# Altium schematic sheet 07-KSZ9031_1G_BASET_XCVR.SchDoc
size C; SheetNumber: 7; SheetTotal: 13
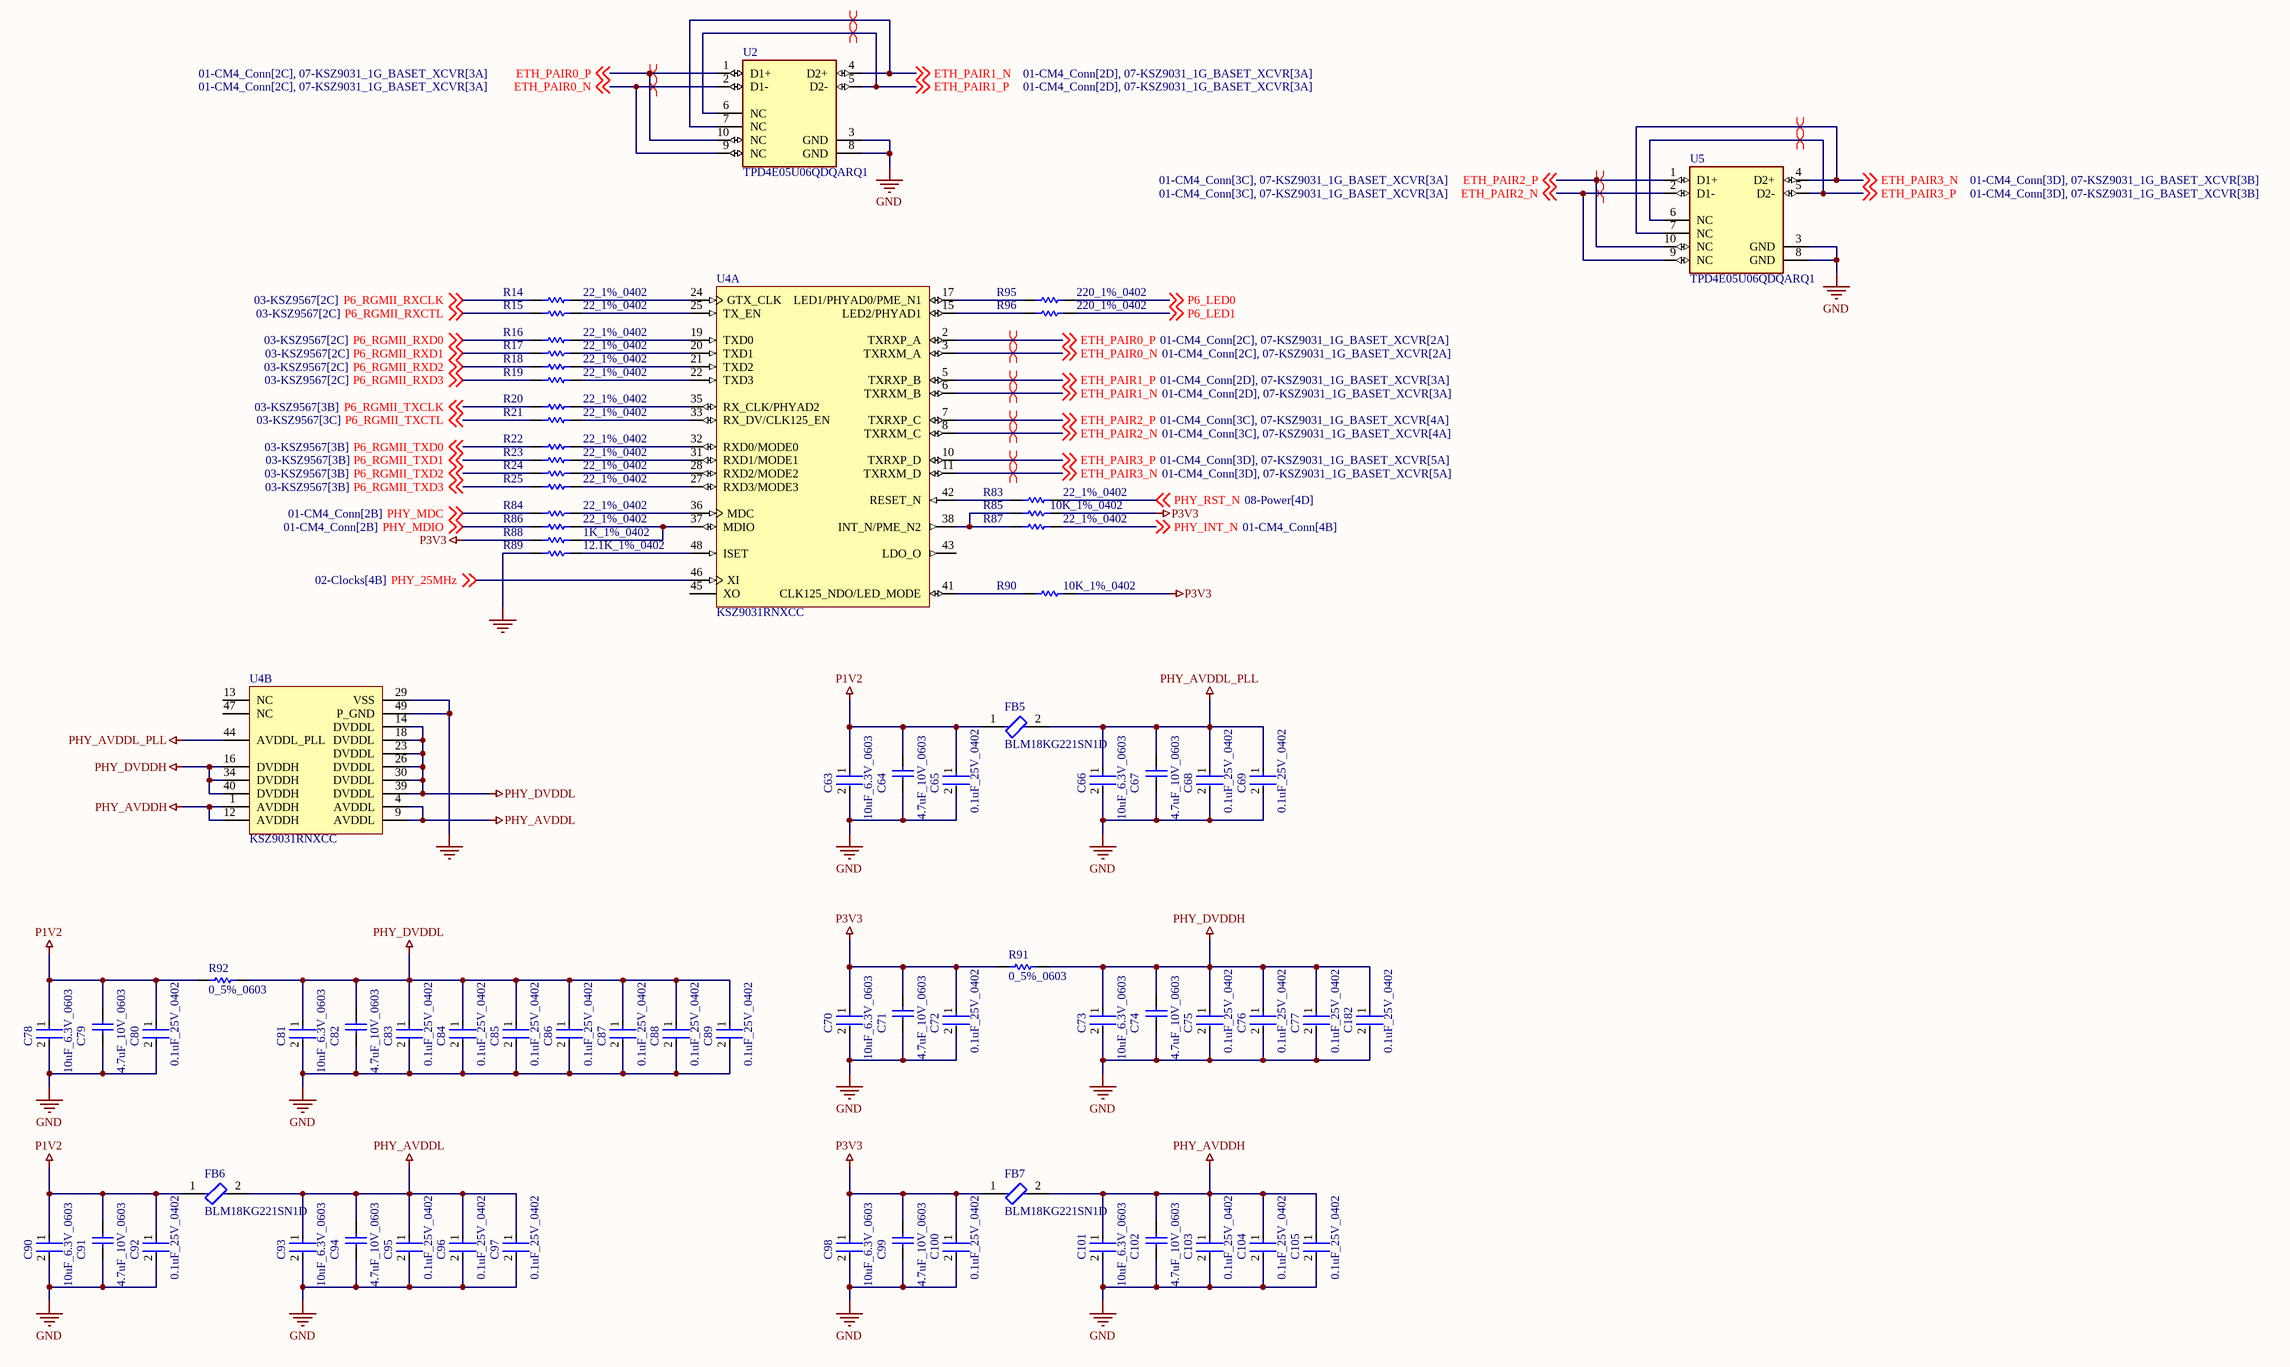
[diagram p0: 07-KSZ9031_1G_BASET_XCVR.SchDoc]

## Parts
C63  10uF_6.3V_0603  [FP-C0603C106M9PACTU-MFG]
C64  4.7uF_10V_0603  [CAPC1608X87X35NL15T15]
C65  0.1uF_25V_0402  [FP-0402-L_1_0_1-W_0_5_0_1-IPC_C]
C66  10uF_6.3V_0603  [FP-C0603C106M9PACTU-MFG]
C67  4.7uF_10V_0603  [CAPC1608X87X35NL15T15]
C68  0.1uF_25V_0402  [FP-0402-L_1_0_1-W_0_5_0_1-IPC_C]
C69  0.1uF_25V_0402  [FP-0402-L_1_0_1-W_0_5_0_1-IPC_C]
C70  10uF_6.3V_0603  [FP-C0603C106M9PACTU-MFG]
C71  4.7uF_10V_0603  [CAPC1608X87X35NL15T15]
C72  0.1uF_25V_0402  [FP-0402-L_1_0_1-W_0_5_0_1-IPC_C]
C73  10uF_6.3V_0603  [FP-C0603C106M9PACTU-MFG]
C74  4.7uF_10V_0603  [CAPC1608X87X35NL15T15]
C75  0.1uF_25V_0402  [FP-0402-L_1_0_1-W_0_5_0_1-IPC_C]
C76  0.1uF_25V_0402  [FP-0402-L_1_0_1-W_0_5_0_1-IPC_C]
C77  0.1uF_25V_0402  [FP-0402-L_1_0_1-W_0_5_0_1-IPC_C]
C78  10uF_6.3V_0603  [FP-C0603C106M9PACTU-MFG]
C79  4.7uF_10V_0603  [CAPC1608X87X35NL15T15]
C80  0.1uF_25V_0402  [FP-0402-L_1_0_1-W_0_5_0_1-IPC_C]
C81  10uF_6.3V_0603  [FP-C0603C106M9PACTU-MFG]
C82  4.7uF_10V_0603  [CAPC1608X87X35NL15T15]
C83  0.1uF_25V_0402  [FP-0402-L_1_0_1-W_0_5_0_1-IPC_C]
C84  0.1uF_25V_0402  [FP-0402-L_1_0_1-W_0_5_0_1-IPC_C]
C85  0.1uF_25V_0402  [FP-0402-L_1_0_1-W_0_5_0_1-IPC_C]
C86  0.1uF_25V_0402  [FP-0402-L_1_0_1-W_0_5_0_1-IPC_C]
C87  0.1uF_25V_0402  [FP-0402-L_1_0_1-W_0_5_0_1-IPC_C]
C88  0.1uF_25V_0402  [FP-0402-L_1_0_1-W_0_5_0_1-IPC_C]
C89  0.1uF_25V_0402  [FP-0402-L_1_0_1-W_0_5_0_1-IPC_C]
C90  10uF_6.3V_0603  [FP-C0603C106M9PACTU-MFG]
C91  4.7uF_10V_0603  [CAPC1608X87X35NL15T15]
C92  0.1uF_25V_0402  [FP-0402-L_1_0_1-W_0_5_0_1-IPC_C]
C93  10uF_6.3V_0603  [FP-C0603C106M9PACTU-MFG]
C94  4.7uF_10V_0603  [CAPC1608X87X35NL15T15]
C95  0.1uF_25V_0402  [FP-0402-L_1_0_1-W_0_5_0_1-IPC_C]
C96  0.1uF_25V_0402  [FP-0402-L_1_0_1-W_0_5_0_1-IPC_C]
C97  0.1uF_25V_0402  [FP-0402-L_1_0_1-W_0_5_0_1-IPC_C]
C98  10uF_6.3V_0603  [FP-C0603C106M9PACTU-MFG]
C99  4.7uF_10V_0603  [CAPC1608X87X35NL15T15]
C100  0.1uF_25V_0402  [FP-0402-L_1_0_1-W_0_5_0_1-IPC_C]
C101  10uF_6.3V_0603  [FP-C0603C106M9PACTU-MFG]
C102  4.7uF_10V_0603  [CAPC1608X87X35NL15T15]
C103  0.1uF_25V_0402  [FP-0402-L_1_0_1-W_0_5_0_1-IPC_C]
C104  0.1uF_25V_0402  [FP-0402-L_1_0_1-W_0_5_0_1-IPC_C]
C105  0.1uF_25V_0402  [FP-0402-L_1_0_1-W_0_5_0_1-IPC_C]
C182  0.1uF_25V_0402  [FP-0402-L_1_0_1-W_0_5_0_1-IPC_C]
FB5  BLM18KG221SN1D  [FP-BLM18-0_15-t0_8-IPC_B]
FB6  BLM18KG221SN1D  [FP-BLM18-0_15-t0_8-IPC_B]
FB7  BLM18KG221SN1D  [FP-BLM18-0_15-t0_8-IPC_B]
R14  22_1%_0402  [RESC1005X40X25ML05T10]
R15  22_1%_0402  [RESC1005X40X25ML05T10]
R16  22_1%_0402  [RESC1005X40X25ML05T10]
R17  22_1%_0402  [RESC1005X40X25ML05T10]
R18  22_1%_0402  [RESC1005X40X25ML05T10]
R19  22_1%_0402  [RESC1005X40X25ML05T10]
R20  22_1%_0402  [RESC1005X40X25ML05T10]
R21  22_1%_0402  [RESC1005X40X25ML05T10]
R22  22_1%_0402  [RESC1005X40X25ML05T10]
R23  22_1%_0402  [RESC1005X40X25ML05T10]
R24  22_1%_0402  [RESC1005X40X25ML05T10]
R25  22_1%_0402  [RESC1005X40X25ML05T10]
R83  22_1%_0402  [RESC1005X40X25ML05T10]
R84  22_1%_0402  [RESC1005X40X25ML05T10]
R85  10K_1%_0402  [RESC1005X40X25NL10T10]
R86  22_1%_0402  [RESC1005X40X25ML05T10]
R87  22_1%_0402  [RESC1005X40X25ML05T10]
R88  1K_1%_0402  [RESC1005X40X25ML05T10]
R89  12.1K_1%_0402  [RESC1005X40X25NL10T10]
R90  10K_1%_0402  [RESC1005X40X25NL10T10]
R91  0_5%_0603  [RESC1608X55X25ML10T15]
R92  0_5%_0603  [RESC1608X55X25ML10T15]
R95  220_1%_0402  [RESC1005X40X25NL05T10]
R96  220_1%_0402  [RESC1005X40X25NL05T10]
U2  TPD4E05U06QDQARQ1  [FP-DQA0010A-MFG]
U4  KSZ9031RNXCC  [MICL-QFN-48_V]  (parts A,B of 2)
U5  TPD4E05U06QDQARQ1  [FP-DQA0010A-MFG]

## Nets
GND: C63.2 C64.1 C65.2 C66.2 C67.1 C68.2 C69.2 C70.2 C71.1 C72.2 C73.2 C74.1 C75.2 C76.2 C77.2 C78.2 C79.1 C80.2 C81.2 C82.1 C83.2 C84.2 C85.2 C86.2 C87.2 C88.2 C89.2 C90.2 C91.1 C92.2 C93.2 C94.1 C95.2 C96.2 C97.2 C98.2 C99.1 C100.2 C101.2 C102.1 C103.2 C104.2 C105.2 C182.2 R89.1 U2.3(GND) U2.8(GND) U4.29(VSS) U4.49(P_GND) U5.3(GND) U5.8(GND)
P1V2: C63.1 C64.2 C65.1 C78.1 C79.2 C80.1 C90.1 C91.2 C92.1 FB5.1 FB6.1 R92.1
P3V3: C70.1 C71.2 C72.1 C98.1 C99.2 C100.1 FB7.1 R85.2 R88.1 R90.2 R91.1
PHY_AVDDH: C101.1 C102.2 C103.1 C104.1 C105.1 FB7.2 U4.1(AVDDH) U4.12(AVDDH)
PHY_AVDDL: C93.1 C94.2 C95.1 C96.1 C97.1 FB6.2 U4.4(AVDDL) U4.9(AVDDL)
PHY_AVDDL_PLL: C66.1 C67.2 C68.1 C69.1 FB5.2 U4.44(AVDDL_PLL)
PHY_DVDDH: C73.1 C74.2 C75.1 C76.1 C77.1 C182.1 R91.2 U4.16(DVDDH) U4.34(DVDDH) U4.40(DVDDH)
PHY_DVDDL: C81.1 C82.2 C83.1 C84.1 C85.1 C86.1 C87.1 C88.1 C89.1 R92.2 U4.14(DVDDL) U4.18(DVDDL) U4.23(DVDDL) U4.26(DVDDL) U4.30(DVDDL) U4.39(DVDDL)
ETH_PAIR0_N: U2.2(D1-) U2.9(NC) U4.3(TXRXM_A) ; off-sheet ETH_PAIR0_N
ETH_PAIR0_P: U2.1(D1+) U2.10(NC) U4.2(TXRXP_A) ; off-sheet ETH_PAIR0_P
ETH_PAIR1_N: U2.4(D2+) U2.7(NC) U4.6(TXRXM_B) ; off-sheet ETH_PAIR1_N
ETH_PAIR1_P: U2.5(D2-) U2.6(NC) U4.5(TXRXP_B) ; off-sheet ETH_PAIR1_P
ETH_PAIR2_N: U4.8(TXRXM_C) U5.2(D1-) U5.9(NC) ; off-sheet ETH_PAIR2_N
ETH_PAIR2_P: U4.7(TXRXP_C) U5.1(D1+) U5.10(NC) ; off-sheet ETH_PAIR2_P
ETH_PAIR3_N: U4.11(TXRXM_D) U5.4(D2+) U5.7(NC) ; off-sheet ETH_PAIR3_N
ETH_PAIR3_P: U4.10(TXRXP_D) U5.5(D2-) U5.6(NC) ; off-sheet ETH_PAIR3_P
P6_LED0: R95.2 ; off-sheet P6_LED0
P6_LED1: R96.2 ; off-sheet P6_LED1
P6_RGMII_RXCLK: R14.1 ; off-sheet P6_RGMII_RXCLK
P6_RGMII_RXCTL: R15.1 ; off-sheet P6_RGMII_RXCTL
P6_RGMII_RXD0: R16.1 ; off-sheet P6_RGMII_RXD0
P6_RGMII_RXD1: R17.1 ; off-sheet P6_RGMII_RXD1
P6_RGMII_RXD2: R18.1 ; off-sheet P6_RGMII_RXD2
P6_RGMII_RXD3: R19.1 ; off-sheet P6_RGMII_RXD3
P6_RGMII_TXCLK: R20.1 ; off-sheet P6_RGMII_TXCLK
P6_RGMII_TXCTL: R21.1 ; off-sheet P6_RGMII_TXCTL
P6_RGMII_TXD0: R22.1 ; off-sheet P6_RGMII_TXD0
P6_RGMII_TXD1: R23.1 ; off-sheet P6_RGMII_TXD1
P6_RGMII_TXD2: R24.1 ; off-sheet P6_RGMII_TXD2
P6_RGMII_TXD3: R25.1 ; off-sheet P6_RGMII_TXD3
PHY_25MHz: U4.46(XI) ; off-sheet PHY_25MHz
PHY_INT_N: R87.2 ; off-sheet PHY_INT_N
PHY_MDC: R84.1 ; off-sheet PHY_MDC
PHY_MDIO: R86.1 ; off-sheet PHY_MDIO
PHY_RST_N: R83.2 ; off-sheet PHY_RST_N
NetR14_2: R14.2 U4.24(GTX_CLK)
NetR15_2: R15.2 U4.25(TX_EN)
NetR16_2: R16.2 U4.19(TXD0)
NetR17_2: R17.2 U4.20(TXD1)
NetR18_2: R18.2 U4.21(TXD2)
NetR19_2: R19.2 U4.22(TXD3)
NetR20_2: R20.2 U4.35(RX_CLK/PHYAD2)
NetR21_2: R21.2 U4.33(RX_DV/CLK125_EN)
NetR22_2: R22.2 U4.32(RXD0/MODE0)
NetR23_2: R23.2 U4.31(RXD1/MODE1)
NetR24_2: R24.2 U4.28(RXD2/MODE2)
NetR25_2: R25.2 U4.27(RXD3/MODE3)
NetR83_1: R83.1 U4.42(RESET_N)
NetR84_2: R84.2 U4.36(MDC)
NetR85_1: R85.1 R87.1 U4.38(INT_N/PME_N2)
NetR86_2: R86.2 R88.2 U4.37(MDIO)
NetR89_2: R89.2 U4.48(ISET)
NetR90_1: R90.1 U4.41(CLK125_NDO/LED_MODE)
NetR95_1: R95.1 U4.17(LED1/PHYAD0/PME_N1)
NetR96_1: R96.1 U4.15(LED2/PHYAD1)

Not connected (* = marked no-connect by the designer): U4 13(NC) 43(LDO_O) 45(XO) 47(NC)

## Layout directives
differential pair: ETH_PAIR0_N, ETH_PAIR0_P, ETH_PAIR1_N, ETH_PAIR1_P, ETH_PAIR2_N, ETH_PAIR2_P, ETH_PAIR3_N, ETH_PAIR3_P

## Library data of the parts
C63 C66 C70 C73 C78 C81 C90 C93 C98 C101 = CMP-2006-02285-3: CAP CER 10UF 6.3V X5R 0603; Manufacturer Part Number: C0603C106M9PACTU; Manufacturer: Kemet; Material: Ceramic; Temperature Coefficient: 15%; Tolerance: 20%; Category: Cap; Height: 0.9mm; Digikey Description: CAP CER 10UF 6.3V X5R 0603; Mouser Description: In a Pack of 10, KEMET 0603 (1608M) 10µF MLCC 6.3V dc ±20% SMD C0603C106M9PACTU; Voltage Rating: 6.3V; Device Class L2: Capacitors; Temperature Range Low: -55°C; Temperature Characteristic: X5R; ComponentLink2Description: Datasheet; Ipc Land Pattern Name: CAPC16080X80; ComponentLink2URL: http://www.kemet.com/Lists/ProductCatalog/Attachments/19/KEM_C1006_X5R_SMD.pdf; Capacitance: 10uF; Temperature Range High: +85°C; Device Class L3: Ceramic Capacitors; RoHS: TRUE; Automotive: No; Value: 10uF; Temperature: -55°C to +85°C; Device Class L1: Passive Components; Package: C0603C106M9PACTU; Lead Free: Yes; Octopart: https://octopart.com/c0603c106m9pactu-kemet-8375727
C64 C67 C71 C74 C79 C82 C91 C94 C99 C102 = CMP-2006-03238-1: Part Number: C0603C475K8PACTU; Manufacturer: Kemet
C65 C68 C69 C72 C75-C77 C80 C83-C89 C92 C95-C97 C100 C103-C105 C182 = CMP-2008-02519-2: General Purpose Ceramic Capacitor, 0402, 100nF, 10%, X7R, 15%, 25V; Package Quantity: 1; Capacitance: 100nF; Min Operating Temperature: -55°C; Voltage: 25V; Voltage Rating: 25V; Construction: Flat; Max Operating Temperature: 125°C; Radiation Hardening: No; Depth: 0.5mm; Thickness: 0.022inch; Voltage Rating (DC): 25V; Number of Pins: 2; Lead Free: Lead Free; Series: -; REACH SVHC: No SVHC; Length: 1mm; Dielectric: X7R; RoHS Compliant: Yes; Mount: Surface Mount; Packaging: Tape and Reel; Case/Package: 0402; Case Code (Imperial): 0402; Termination: SMD/SMT; Width: 0.02inch; Case Code (Metric): 1005; Tolerance: 10%
FB5-FB7 = CMP-0686-00556-7: Chip Ferrite Bead, 0603, 220Ω @ 100MHz, 0.05Ω, 25%, 2.2A; DC Resistance (DCR): 50mR; Number of Circuits: 1; Impedance: 220R; Current Rating: 2.2A; Material: Ferrite; Test Frequency: 100MHz; Depth: 0.8mm; Series: BLM18K; RoHS Compliant: Yes; Termination: SMD/SMT; Max Current Rating: 2.2A; Case Code (Metric): 1608; Radiation Hardening: No; Number of Pins: 2; Length: 1.6mm; Lead Free: Lead Free; Package Quantity: 1; Height: 0.8mm; Core Material: Ferrite; Inductor Type: FERRITE BEAD; Min Operating Temperature: -55°C; Case/Package: 0603; Case Code (Imperial): 0603; Number of Lines: 1; Packaging: Tape and Reel; REACH SVHC: No SVHC; Max Operating Temperature: 125°C; Military Standard: Not; DC Resistance-Max: 50mR; Width: 0.8mm; DC Current: 2.2A; Max DC Current: 2.2A; Tolerance: 25%; Weight: 7.1E-05oz
R14-R25 R83 R84 R86 R87 = CMP-2002-07182-1: Part Number: RC0402FR-1322RL; Manufacturer: Yageo / Phycomp
R85 R90 = CMP-2002-04694-1: Manufacturer: Bourns; Part Number: CR0402-FX-1002GLF
R88 = CMP-2002-06478-1: Manufacturer: Multicomp; Part Number: MCMR04X1001FTL
R89 = CMP-2002-05926-1: Manufacturer: Multicomp; Part Number: MC00625W0402112K1
R91 R92 = CMP-2100-03667-1: Chip Resistor, 0 Ohm, +/- 5%, 0.1 W, -55 to 155 degC, 0603 (1608 Metric), RoHS, Tape and Reel; Manufacturer: Yageo; Temperature Coefficient: 200ppm/degreesC; Voltage Rating: 50V; Power Rating: 100mW; Resistance: 0mOhm; Width: 0.8mm; Max Operating Temperature: 155degC; Tolerance: 5%; Package Reference: 0603; Height: 0.45mm; Depth: 0.8mm; Package Description: 2-Pin Surface Mount Device, Body 1.6 x 0.8 mm; Termination: SMD/SMT; Package Quantity: 5000; Case/Package: 0603; Case Code (Imperial): 0603; Radiation Hardening: No; Number of Pins: 2; Length: 1.6mm; Lead Free: LeadFree; Voltage Rating (DC): 50V; Military Standard: Not; Datasheet URL: http://www.yageo.com/NewPortal/yageodocoutput?fileName=/pdf/R-Chip/PYu-RC_Group_51_RoHS_L_5.pdf; Manufacturer URL: http://www.yageo.com/; Packaging: TapeandReel; Case Code (Metric): 1608; Min Operating Temperature: -55degC; Composition: ThickFilm; RoHSCompliant: true; Contact Plating: Tin; Datasheet Version: Rev. 5, 10/2016; REACH SVHC: NoSVHC
R95 R96 = CMP-2002-07959-1: Manufacturer: Yageo / Phycomp; Part Number: RC0402JR-07220RL
U2 U5 = CMP-04985-000004-1: TVS DIODE 5.5V 14V 10USON; Manufacturer: Texas Instruments; Direction: Unidirectional; Standoff Height: 0mm; Capacitance: 0.5pF; Number Of Channels: 4; Breakdown Voltage: 6.4V; Peak Pulse Power: 2.5W; Automotive Grade: Grade 1; Value: 0.5pF; Interface: USB,Ethernet,LVDS,Other; Peak Pulse Current: 2.5A; Operating Supply Voltage: 5.5V; Reverse Standoff Voltage: 5.5V; Package: DQA0010A; Temperature Range Low: -40°C; Temperature Range High: +125°C; Ambient Temperature Range Low: -40°C; Device Class L1: Circuit Protection; Clamping Voltage: 14V; Manufacturer Part Number: TPD4E05U06QDQARQ1; Device Class L2: ESD and Circuit Protection ICs; Octopart: https://octopart.com/tpd4e05u06qdqarq1-texas+instruments-48523459; Device Class L3: unset; Height: 0.55mm; Automotive: Yes; ComponentLink2Description: Datasheet; RoHS: TRUE; Ambient Temperature Range High: +125°C; Category: IC; Mouser Description: Automotive 4-Channel ESD Protection Solution for SuperSpeed (up to 5 Gbps) Interface 10-USON -40 to 125; Temperature: -40°C to +125°C; ComponentLink2URL: http://www.ti.com/lit/ds/symlink/tpd4e05u06-q1.pdf; Digikey Description: TVS DIODE 5.5V 14V 10USON; Lead Free: Yes
U4 = CMP-1337-00003-2: Gigabit Ethernet Transceiver with RGMII Support, 1.14 to 1.26 V, 0 to 70 degC, 48-Pin QFN, RoHS; Manufacturer: Micrel; Output Tri-State Leakage: 10 uA Max.; ILED: 8 mA Typ.; Receivers: 4; VSET@R(ISET): 12.1 KOhm=1.2 V Typ.; DatasheetVersion: Rev. 2.1; PackageDescription: 48-Pin Quad Flat Non-Lead Package, Body 7 x 7 mm, Pitch 0.5 mm; RoHS: TRUE; DVDDL: 1.14 to 1.26 V; ComponentLink1URL: http://www.micrel.com/; PartNumber: KSZ9031RNXCC; Temperature Range: 0 to 70 degC; ComponentLink1Description: Manufacturer URL; ComponentLink3Description: Package Specification; Mounting Technology: Surface Mount; ComponentLink2Description: Datasheet; Drivers: 4; ComponentLink2URL: http://www.micrel.com/_PDF/Ethernet/datasheets/KSZ9031RNX.pdf; ComponentLink3URL: http://www.micrel.com/_PDF/Ethernet/datasheets/KSZ9031RNX.pdf